# Altium schematic sheet CORE.SchDoc
size A4
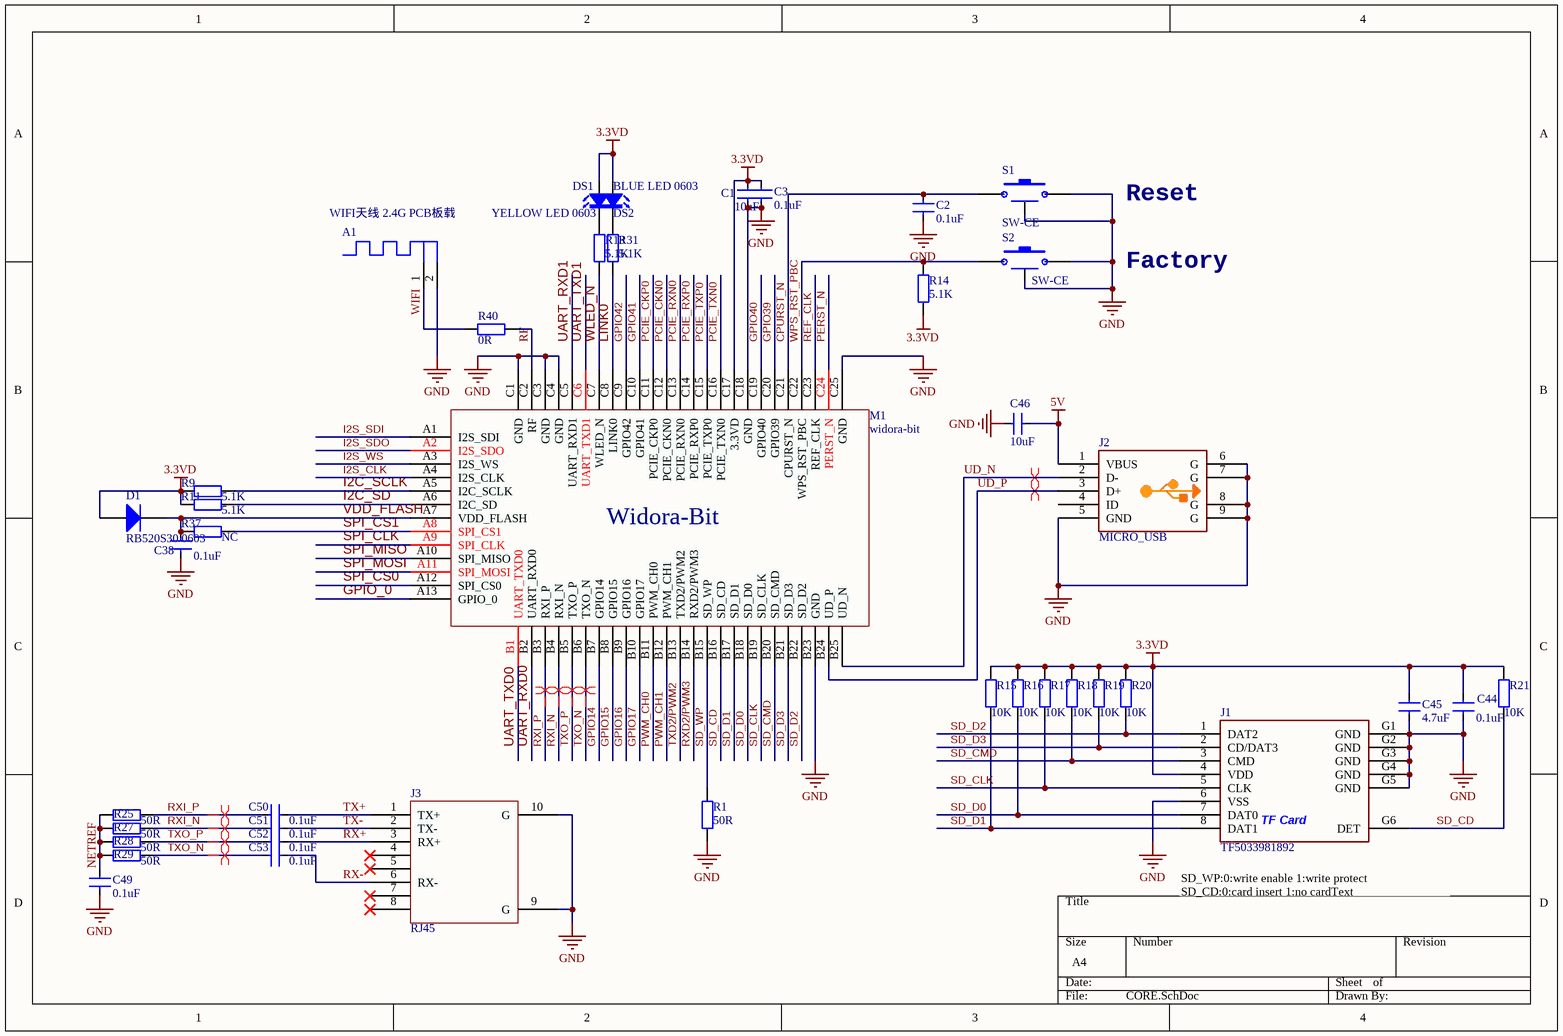
[diagram p0: CORE.SchDoc]

## Parts
A1  WIFI天线 2.4G PCB板载  [2.4G - mirror]
C1  10uF  [0805C]
C2  0.1uF  [C0402]
C3  0.1uF  [C0402]
C38  0.1uF  [C0402]
C44  0.1uF  [C0402]
C45  4.7uF  [C0402]
C46  10uF  [0805C]
C49  0.1uF  [C0402]
C50  0.1uF  [C0402]
C51  0.1uF  [C0402]
C52  0.1uF  [C0402]
C53  0.1uF  [C0402]
D1  RB520S30 0603  [SOD523]
DS1  YELLOW LED 0603  [LED0603]
DS2  BLUE LED 0603  [LED0603]
J1  TF5033981892  [TFCARD]
J2  MICRO_USB  [MICROUSB]
J3  RJ45  [RJ45]
M1  widora-bit  [widora-core]
R1  50R  [R0402]
R9  5.1K  [R0402]
R11  5.1K  [R0402]
R13  5.1K  [R0402]
R14  5.1K  [R0402]
R15  10K  [R0402]
R16  10K  [R0402]
R17  10K  [R0402]
R18  10K  [R0402]
R19  10K  [R0402]
R20  10K  [R0402]
R21  10K  [R0402]
R25  50R  [R0402]
R27  50R  [R0402]
R28  50R  [R0402]
R29  50R  [R0402]
R31  5.1K  [R0402]
R37  NC  [R0402]
R40  0R  [R0402]
S1  SW-CE  [KEY-A06]
S2  SW-CE  [KEY-A06]

## Nets
3.3VD: C1.2 C3.2 C44.1 C45.1 D1.A DS1.A DS2.A J1.4(VDD) M1.C17(3.3VD) R9.2 R11.2 R14.1 R15.1 R16.1 R17.1 R18.1 R19.1 R20.1 R21.1
5V: C46.1 J2.1(VBUS)
GND: A1.2(G) C1.1 C2.1 C3.1 C38.1 C44.2 C45.2 C46.2 C49.1 J1.6(VSS) J1.G1(GND) J1.G2(GND) J1.G3(GND) J1.G4(GND) J1.G5(GND) J2.5(GND) J2.6(G) J2.7(G) J2.8(G) J2.9(G) J3.9(G) J3.10(G) M1.B23(GND) M1.C1(GND) M1.C3(GND) M1.C4(GND) M1.C18(GND) M1.C25(GND) R1.2 S1.0 S1.2 S2.0 S2.1
CPURST_N: C2.2 M1.C21(CPURST_N) S1.1
GPIO14: M1.B7(GPIO14)
GPIO15: M1.B8(GPIO15)
GPIO16: M1.B9(GPIO16)
GPIO17: M1.B10(GPIO17)
GPIO39: M1.C20(GPIO39)
GPIO40: M1.C19(GPIO40)
GPIO41: M1.C10(GPIO41)
GPIO42: M1.C9(GPIO42)
GPIO_0: M1.A13(GPIO_0)
I2C_SCLK: M1.A5(I2C_SCLK) R9.1
I2C_SD: M1.A6(I2C_SD) R11.1
I2S_CLK: M1.A4(I2S_CLK)
I2S_SDI: M1.A1(I2S_SDI)
I2S_SDO: M1.A2(I2S_SDO)
I2S_WS: M1.A3(I2S_WS)
LINK0: M1.C8(LINK0) R31.2
NETREF: C49.2 R25.2 R27.2 R28.2 R29.2
PCIE_CKN0: M1.C12(PCIE_CKN0)
PCIE_CKP0: M1.C11(PCIE_CKP0)
PCIE_RXN0: M1.C13(PCIE_RXN0)
PCIE_RXP0: M1.C14(PCIE_RXP0)
PCIE_TXN0: M1.C16(PCIE_TXN0)
PCIE_TXP0: M1.C15(PCIE_TXP0)
PERST_N: M1.C24(PERST_N)
PWM_CH0: M1.B11(PWM_CH0)
PWM_CH1: M1.B12(PWM_CH1)
REF_CLK: M1.C23(REF_CLK)
RF: M1.C2(RF) R40.1
RX+: C52.2 J3.3(RX+)
RX-: C53.2 J3.6(RX-)
RXD2/PWM3: M1.B14(RXD2/PWM3)
RXI_N: C51.1 M1.B4(RXI_N) R27.1
RXI_P: C50.1 M1.B3(RXI_P) R25.1
SD_CD: J1.G6(DET) M1.B16(SD_CD) R21.2
SD_CLK: J1.5(CLK) M1.B19(SD_CLK) R17.2
SD_CMD: J1.3(CMD) M1.B20(SD_CMD) R18.2
SD_D0: J1.7(DAT0) M1.B18(SD_D0) R16.2
SD_D1: J1.8(DAT1) M1.B17(SD_D1) R15.2
SD_D2: J1.1(DAT2) M1.B22(SD_D2) R20.2
SD_D3: J1.2(CD/DAT3) M1.B21(SD_D3) R19.2
SD_WP: M1.B15(SD_WP) R1.1
SPI_CLK: M1.A9(SPI_CLK)
SPI_CS0: M1.A12(SPI_CS0)
SPI_CS1: M1.A8(SPI_CS1) R37.2
SPI_MISO: M1.A10(SPI_MISO)
SPI_MOSI: M1.A11(SPI_MOSI)
TX+: C50.2 J3.1(TX+)
TX-: C51.2 J3.2(TX-)
TXD2/PWM2: M1.B13(TXD2/PWM2)
TXO_N: C53.1 M1.B6(TXO_N) R29.1
TXO_P: C52.1 M1.B5(TXO_P) R28.1
UART_RXD0: M1.B2(UART_RXD0)
UART_RXD1: M1.C5(UART_RXD1)
UART_TXD0: M1.B1(UART_TXD0)
UART_TXD1: M1.C6(UART_TXD1)
UD_N: J2.2(D-) M1.B25(UD_N)
UD_P: J2.3(D+) M1.B24(UD_P)
VDD_FLASH: C38.2 D1.K M1.A7(VDD_FLASH) R37.1
WIFI: A1.1 R40.2
WLED_N: M1.C7(WLED_N) R13.2
WPS_RST_PBC: M1.C22(WPS_RST_PBC) R14.2 S2.2
NetDS1_K: DS1.K R13.1
NetDS2_K: DS2.K R31.1

Not connected (* = marked no-connect by the designer): J2 4(ID); J3 4* 5* 7* 8*

## Layout directives
differential pair: RXI_N, RXI_P, TXO_N, TXO_P, UD_N, UD_P

## Notes on the sheet
- Reset
- Factory
- (near J1) SD_WP:0:write enable 1:write protect
  SD_CD:0:card insert 1:no cardText
- (in symbol TF5033981892) TF Card
- (in symbol widora-bit) Widora-Bit

## Library data of the parts
A1 = ANT2.4G
C1-C3 C38 C44-C46 C49-C53 = CAP: 普通小电容
D1 = Diode: 普通二极管
DS1 = LED: 黄色0603发光二极管
DS2 = LED: 蓝色0603发光二极管
J1 = TF5033981892: Molex TF 卡座
J3 = RJ45: RJ45不带网络变压器
R1 R9 R11 R13-R21 R25 R27-R29 R31 R37 R40 = RES: 普通电阻